# EasyEDA schematic SCH_PCB_sin_SMD-v1_2026-09-21.json
TITLE: Sheet_1; REV: 1.0; Date: 2026-09-19; Sheet: 1/1; Drawn By: meneses.francisco; Company: Your Company
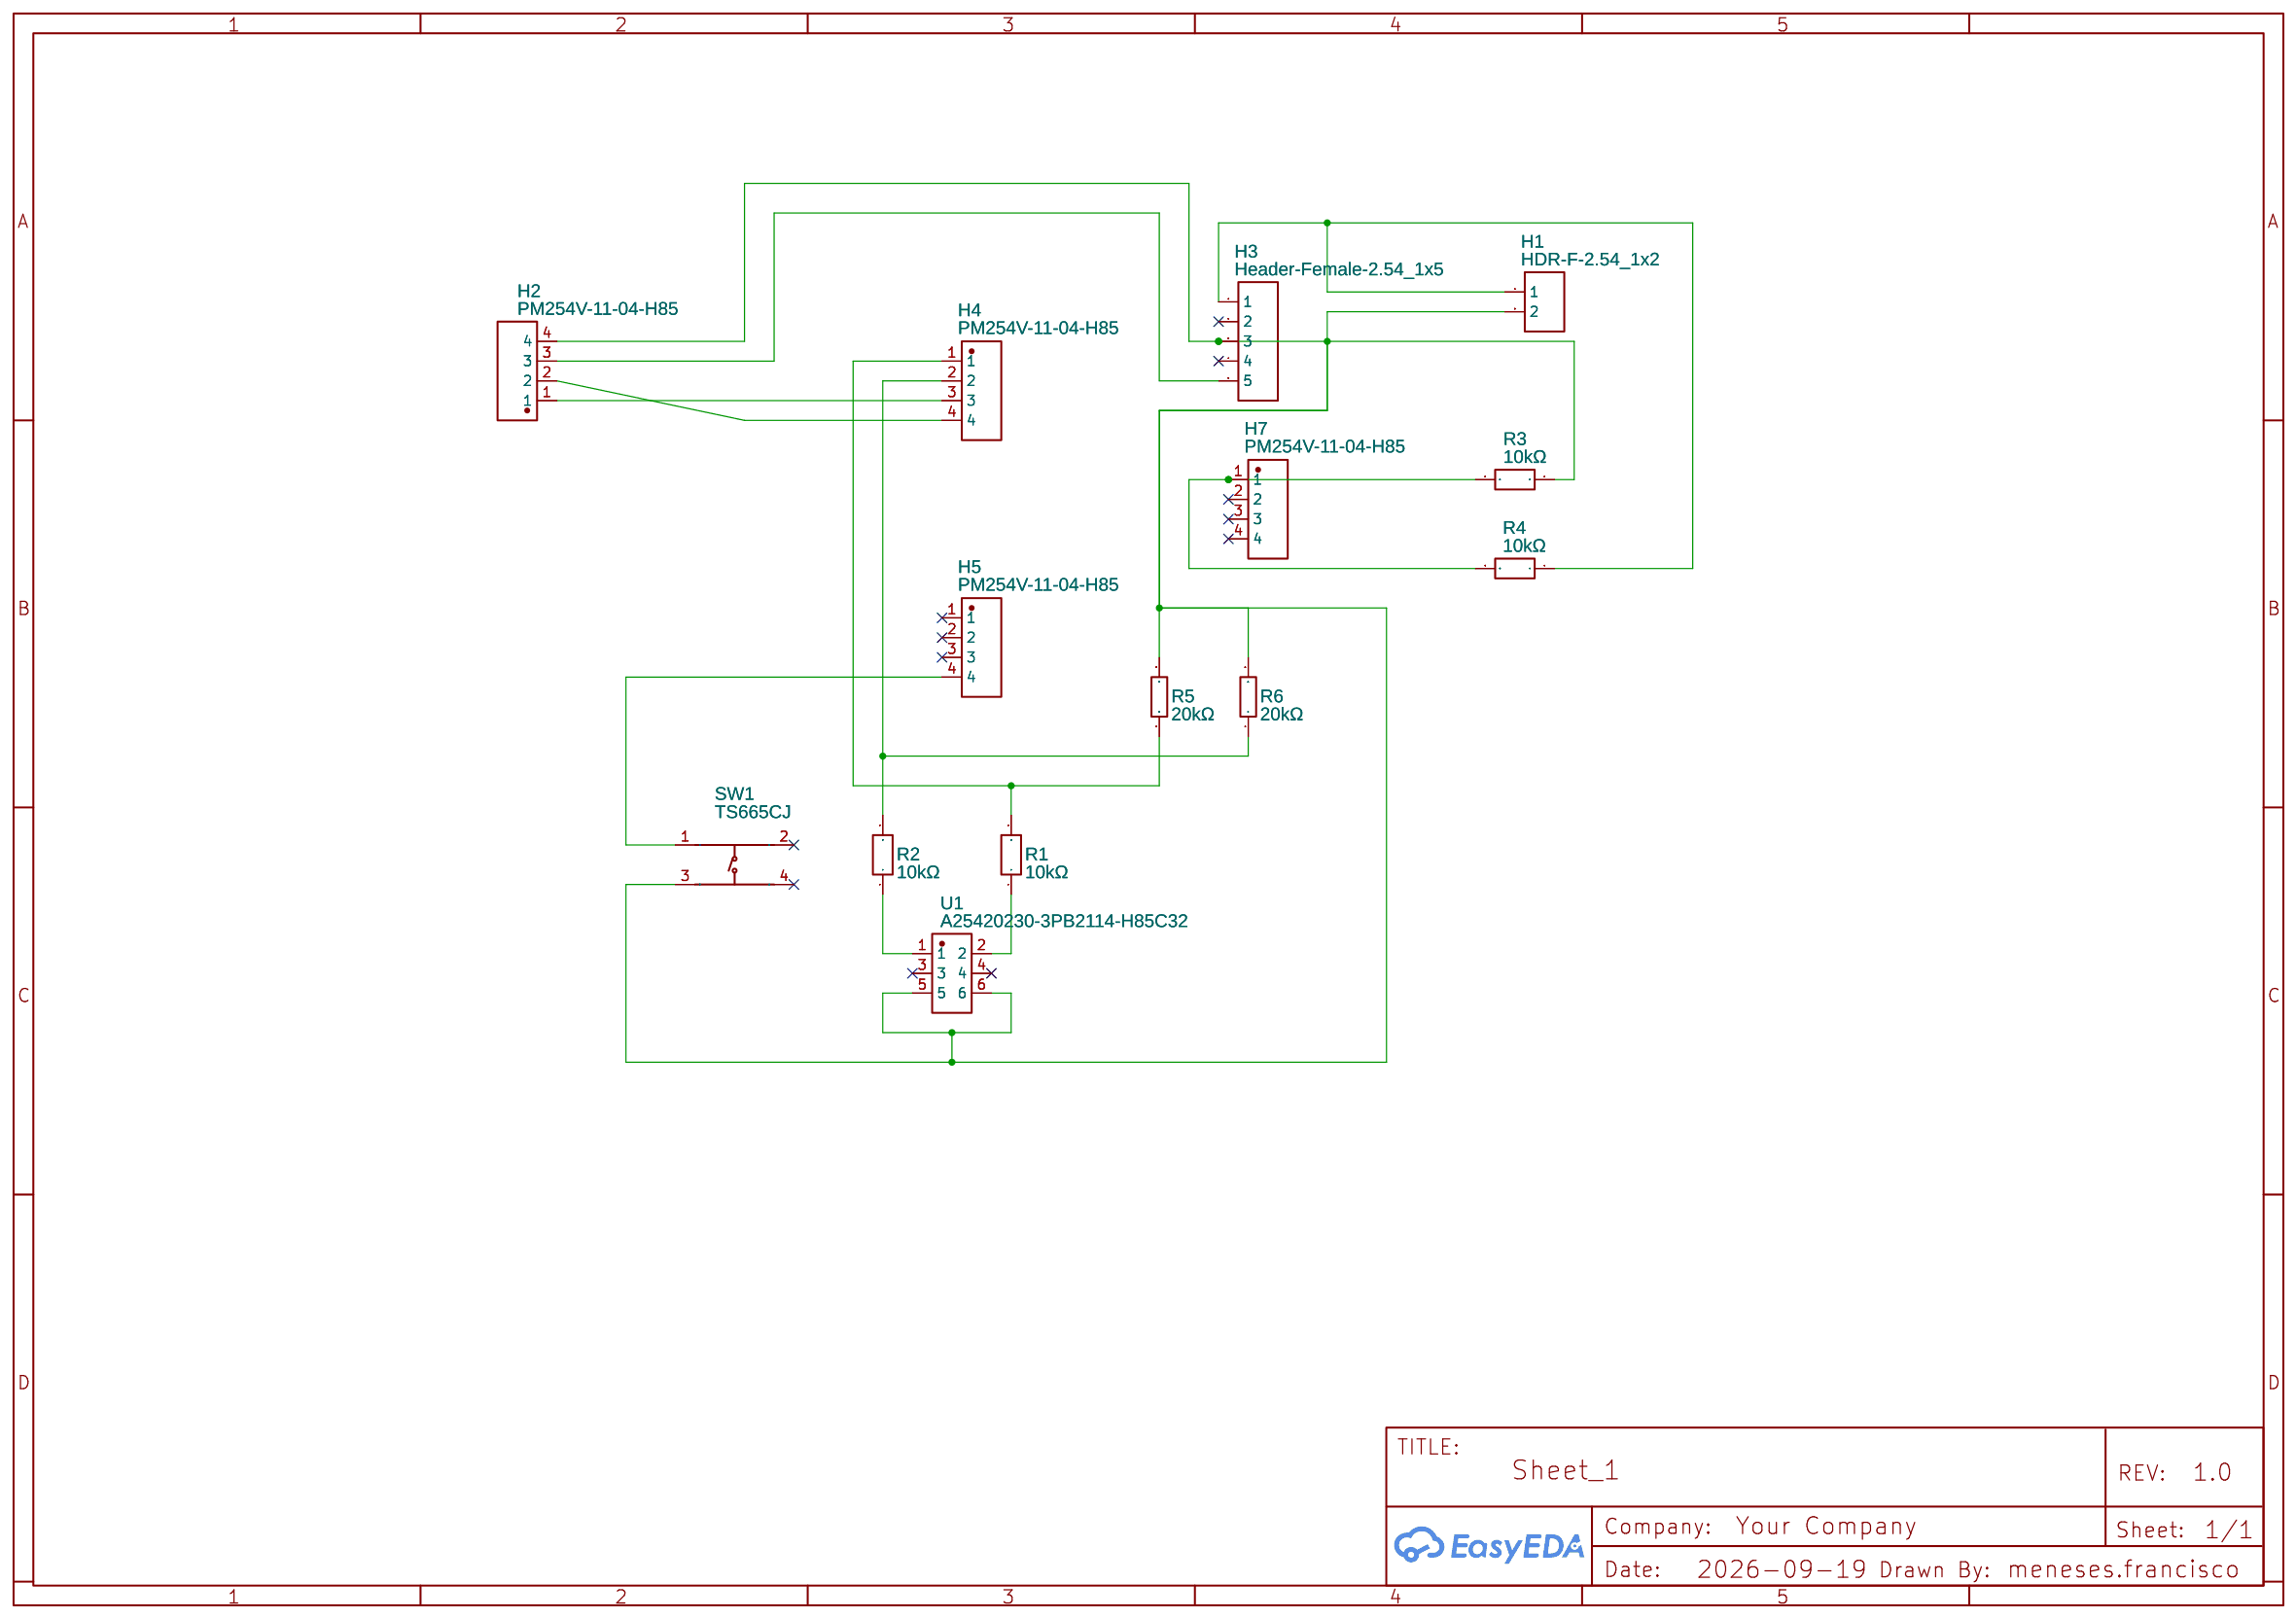
[diagram p0: schematic sheet]

## Parts
H1  HDR-F-2.54_1x2  [HDR-F-2.54_1X2]
H2  PM254V-11-04-H85  [HDR-TH_4P-P2.54-V-F]
H3  Header-Female-2.54_1x5  [HDR-TH_5P-P2.54-V-F]
H4  PM254V-11-04-H85  [HDR-TH_4P-P2.54-V-F]
H5  PM254V-11-04-H85  [HDR-TH_4P-P2.54-V-F]
H7  PM254V-11-04-H85  [HDR-TH_4P-P2.54-V-F]
R1  10kΩ  [RES-TH_BD2.7-L6.2-P10.20-D0.4]
R2  10kΩ  [RES-TH_BD2.7-L6.2-P10.20-D0.4]
R3  10kΩ  [RES-TH_BD2.7-L6.2-P10.20-D0.4]
R4  10kΩ  [RES-TH_BD2.7-L6.2-P10.20-D0.4]
R5  20kΩ  [RES-TH_BD2.3-L6.5-P10.50-D0.5]
R6  20kΩ  [RES-TH_BD2.3-L6.5-P10.50-D0.5]
SW1  TS665CJ  [SW-TH_4P-L6.0-W6.0-P4.50-LS6.5]
U1  A25420230-3PB2114-H85C32  [HDR-TH_6P-P2.54-V-F-R2-C3-S2.54-1]

## Library data of the parts
H1 = HDR-F-2.54_1x2: Supplier Part: C49661; Supplier: LCSC; Contributor: LCEDA_Lib
H2 H4 H5 H7 = PM254V-11-04-H85: Contributor: LCSC; Supplier: LCSC; Supplier Part: C541851; Manufacturer: XFCN(兴飞); JLCPCB Part Class: Extended Part
H3 = Header-Female-2.54_1x5: Supplier: LCSC; Manufacturer: BOOMELE(博穆精密); Manufacturer Part: 2.54-1*5P母; Supplier Part: C50950; JLCPCB Part Class: Extended Part
R1-R4 = MF1/4W-10K±1%-ST52: Contributor: lcsc; Supplier: LCSC; Supplier Part: C2903232; Manufacturer: VO(翔胜); JLCPCB Part Class: Extended Part; link: https://lcsc.com/eda_search?q=C2903232&%26type=1&ref=editor
R5 R6 = MF1/4W-20KΩ±1% T52: Contributor: LCSC; Supplier: LCSC; Supplier Part: C119353; Manufacturer: CCO(千志电子); Manufacturer Part: MF1/4W-20KΩ±1% T; JLCPCB Part Class: Extended Part
SW1 = TS665CJ: Contributor: LCSC; Supplier: LCSC; Supplier Part: C393938; Manufacturer: SHOU HAN(首韩); JLCPCB Part Class: Extended Part
U1 = A25420230-3PB2114-H85C32: Supplier: LCSC; Supplier Part: C49840887; Manufacturer: HMTCONN(华明通); JLCPCB Part Class: Extended Part; Contributor: lcsc

## Nets
Net-(H1-1): H1.1 H3.1 R4.1
Net-(H1-2): H1.2 H2.4 H3.3 R3.1 R5.2 R6.2 SW1.3(C) U1.5 U1.6
Net-(H2-1): H2.1 H4.3
Net-(H2-2): H2.2 H4.4
Net-(H2-3): H2.3 H3.5
Net-(H4-1): H4.1 R1.2 R5.1
Net-(H4-2): H4.2 R2.2 R6.1
Net-(H5-4): H5.4 SW1.1(A)
Net-(H7-1): H7.1 R3.2 R4.2
Net-(R1-1): R1.1 U1.2
Net-(R2-1): R2.1 U1.1

Not connected (* = marked no-connect by the designer): H3 2* 4*; H5 1* 2* 3*; H7 2* 3* 4*; SW1 2(B)* 4(D)*; U1 3* 4*
